# Altium schematic sheet WL-RF-CONN.SchDoc
size 420 x 297 mm; Address1: Address1; Address2: Address2; Address3: Address3; Address4: Address4; DocumentNumber: WOLF-RF-UNIT; SheetNumber: 5; Scale: 1:1; DocumentType: Схема электрическая принципиальная; FirstReferrence: АБВГ.123456.001
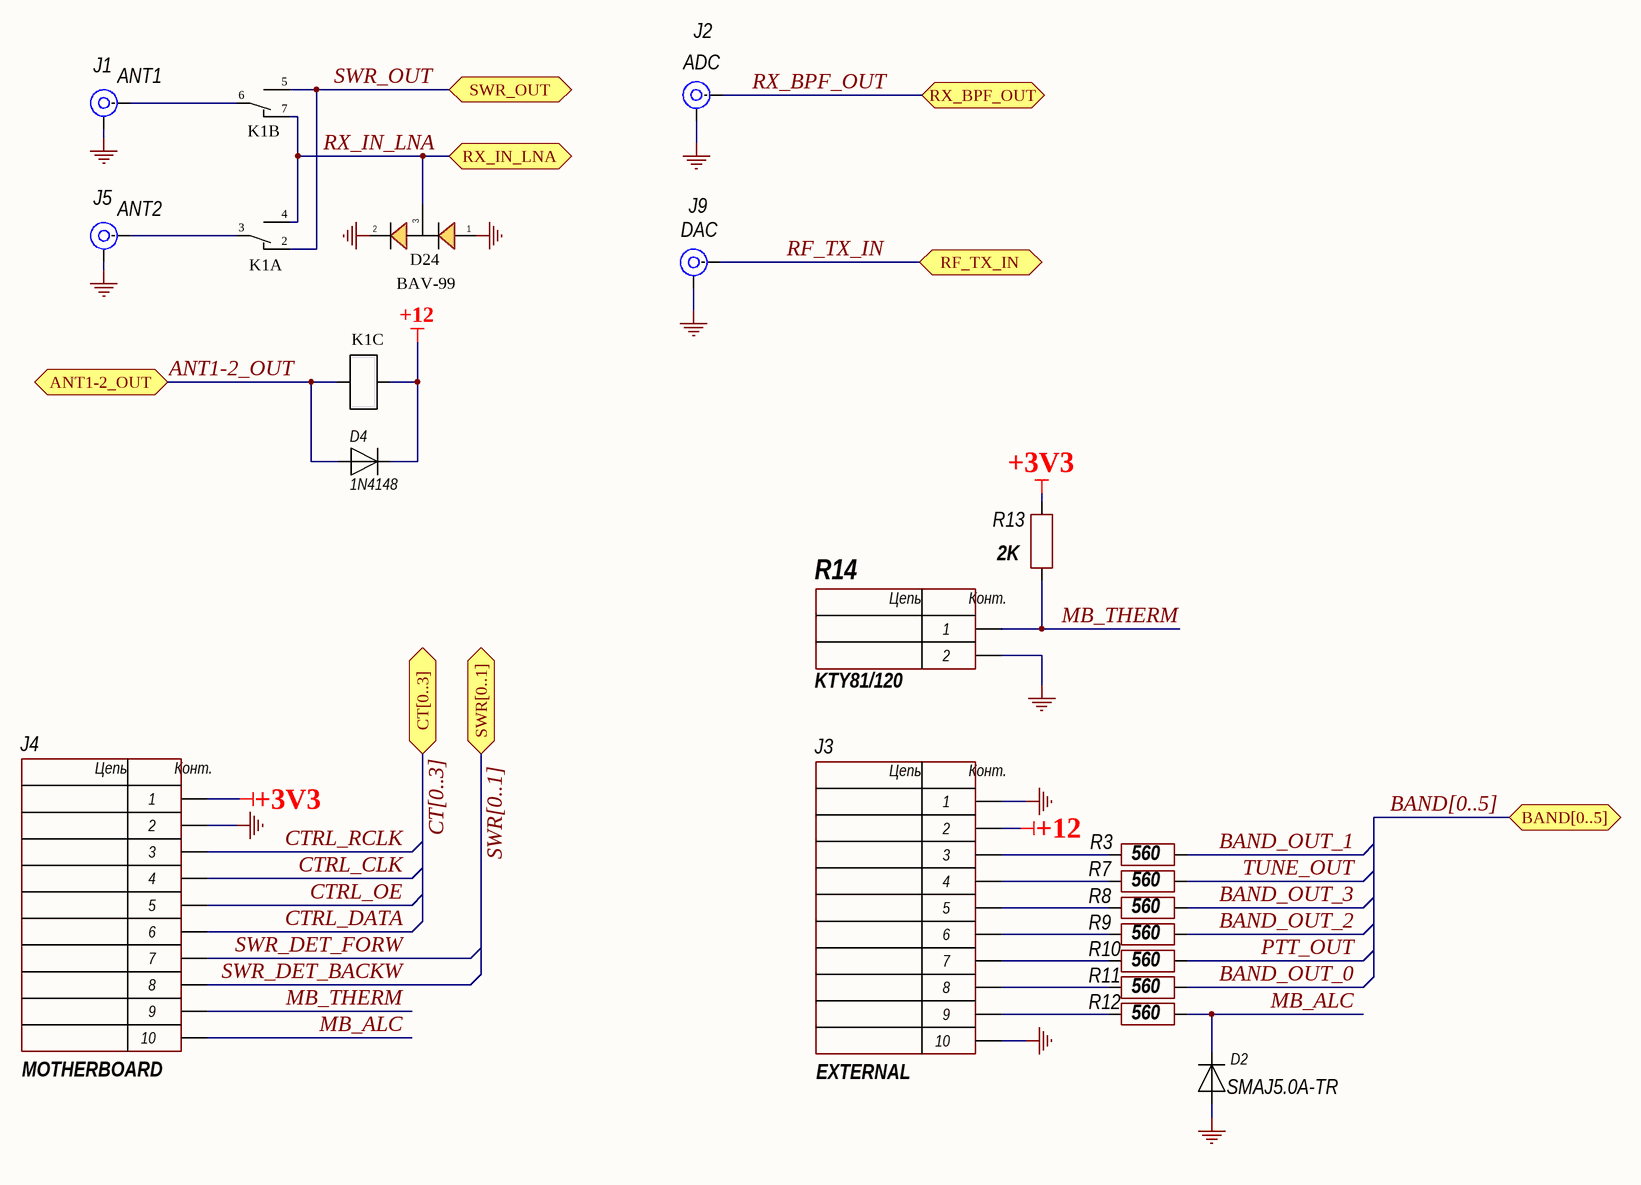
[diagram p0: WL-RF-CONN.SchDoc]

## Parts
D2  SMAJ5.0A-TR  [SOD123]
D4  1N4148  [SOD123]
D24  BAV-99  [SOT23_132]
J1  ANT1  [CON: SMA]
J2  ADC  [CON: SMA]
J3  EXTERNAL  [CON: 0533751010]
J4  MOTHERBOARD  [CON: 0533751010]
J5  ANT2  [CON: SMA]
J9  DAC  [CON: SMA]
K1  IM06  [IMG06]  (value not drawn)  (parts A,B,C of 3)
R3  560  [CH0805R]
R7  560  [CH0805R]
R8  560  [CH0805R]
R9  560  [CH0805R]
R10  560  [CH0805R]
R11  560  [CH0805R]
R12  560  [CH0805R]
R13  2K  [CH0805R]
R14  KTY81/120  [CON: CWF-2]

## Ports
ANT1-2_OUT (bidir), BAND[0..5] (bidir), CT[0..3] (bidir), RF_TX_IN (bidir), RX_BPF_OUT (bidir), RX_IN_LNA (bidir), SWR[0..1] (bidir), SWR_OUT (bidir)

## Nets
+3V3: J4.1 R13.2
+12: D4.2 J3.2 K1.8
GND: D2.1 D24.1 D24.2 J1.2(IN) J2.2(IN) J3.1 J3.10 J4.2 J5.2(IN) J9.2(IN) R14.2
ANT1-2_OUT: D4.1 K1.1 ; port ANT1-2_OUT
BAND_OUT_0: R11.1
BAND_OUT_1: R3.1
BAND_OUT_2: R9.1
BAND_OUT_3: R8.1
CTRL_CLK: J4.4
CTRL_DATA: J4.6
CTRL_OE: J4.5
CTRL_RCLK: J4.3
MB_ALC: D2.2 J4.10 R12.1
MB_THERM: J4.9 R13.1 R14.1
PTT_OUT: R10.1
RF_TX_IN: J9.1(IN) ; port RF_TX_IN
RX_BPF_OUT: J2.1(IN) ; port RX_BPF_OUT
RX_IN_LNA: D24.3 K1.4 K1.7 ; port RX_IN_LNA
SWR_DET_BACKW: J4.8
SWR_DET_FORW: J4.7
SWR_OUT: K1.2 K1.5 ; port SWR_OUT
TUNE_OUT: R7.1
NetJ1_1: J1.1(IN) K1.6
NetJ3_3: J3.3 R3.2
NetJ3_4: J3.4 R7.2
NetJ3_5: J3.5 R8.2
NetJ3_6: J3.6 R9.2
NetJ3_7: J3.7 R10.2
NetJ3_8: J3.8 R11.2
NetJ3_9: J3.9 R12.2
NetJ5_1: J5.1(IN) K1.3

## Buses and harness runs
bus BAND[0..5] = port BAND[0..5]
bus CT[0..3] = port CT[0..3]
bus SWR[0..1] = port SWR[0..1]

## Notes on the sheet
- Подп. и дата
- Инв. № дубл.
- Взам. инв. №
- Инв. № подл.
- Изм.
- Лист
- № докум.
- Подп.
- Дата
- 2.106-A3
- Копировал
- Формат А3
- (in symbol 2-Connector) Цепь; Конт.
- (in symbol 10-Connector) Цепь; Конт.

## Library data of the parts
D2 D4 = Diod: ComponentKind: *; Manufacturer: *; Model: *; HelpURL: *
J1 J2 J5 J9 = SMA: RF; Model: *; Manufacturer: *; HelpURL: *; ComponentKind: *
J3 J4 = 10-Connector: Model: *; Manufacturer: *; HelpURL: *; ComponentKind: *
K1 = IM06-1
R3 R7-R13 = Resistor: Manufacturer: *; Model: *; HelpURL: *; ComponentKind: *; Value: *
R14 = 2-Connector: Model: *; Manufacturer: *; HelpURL: *; ComponentKind: *